# EAGLE design Clock1.1 (EAGLE 7.1.0)
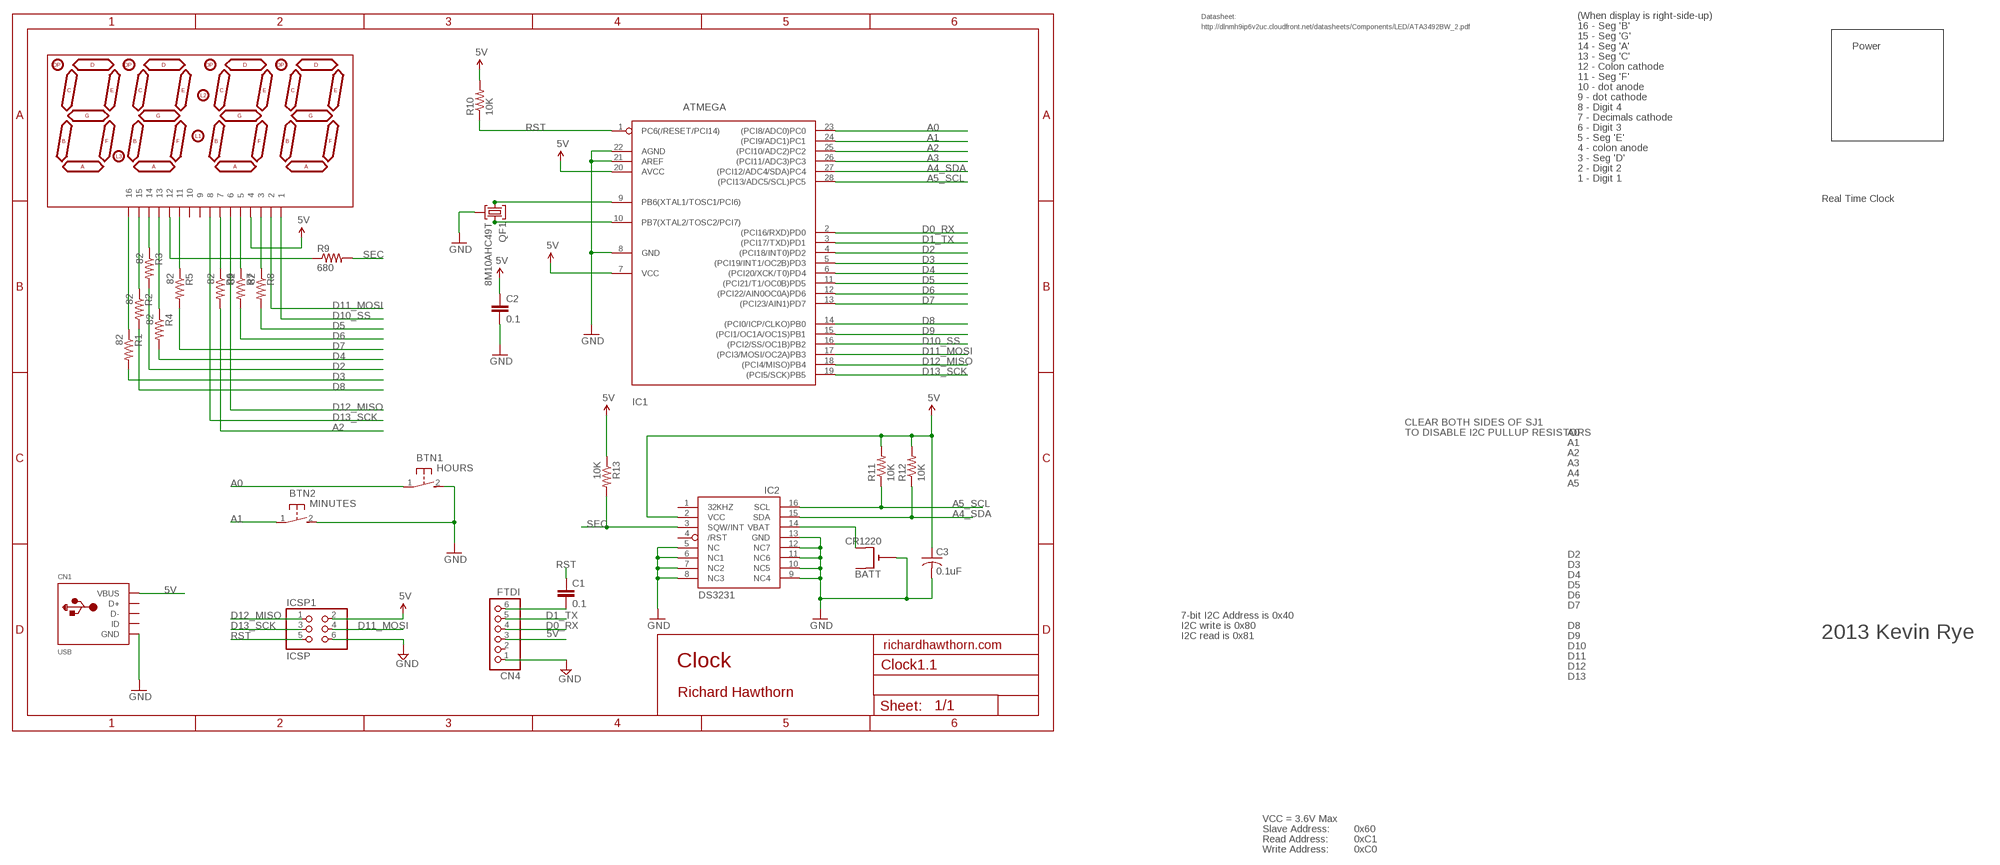
[diagram p0: schematic, sheet 1]

## Parts
BATT  CR1220  CR1220SMT  [CR1220-SMD]
BTN1  HOURS  DTS-3  [DTS-3]
BTN2  MINUTES  DTS-3  [DTS-3]
C1  0.1  CAPPTH2  [CAP-PTH-SMALL2]
C2  0.1  CAPPTH2  [CAP-PTH-SMALL2]
C3  0.1uF  C-US025-025X050  [C025-025X050]
CN1  USB  USBMINIB  [USB-MINIB]
CN4  FTDI  PINHD-1X6  [1X06]
IC1  ATMEGA  ATMEGA168PROUND  [DIL28-3-ROUND]
IC2  DS3231  DS3231/SO  [SO16W]
ICSP1  ICSP  PINHD-2X3  [2X03]
LED1  7SEG-4DIGIT  [SPARKFUN_7-SEGMENT-4DIGIT]
QF1  8M10AHC49T  [HC49U]
R1  82  R-US_0204/7  [0204/7]
R2  82  R-US_0204/7  [0204/7]
R3  82  R-US_0204/7  [0204/7]
R4  82  R-US_0204/7  [0204/7]
R5  82  R-US_0204/7  [0204/7]
R6  82  R-US_0204/7  [0204/7]
R7  82  R-US_0204/7  [0204/7]
R8  82  R-US_0204/7  [0204/7]
R9  680  R-US_0204/7  [0204/7]
R10  10K  R-US_0204/7  [0204/7]
R11  10K  R-US_0204/7  [0204/7]
R12  10K  R-US_0204/7  [0204/7]
R13  10K  R-US_0204/7  [0204/7]

## Nets
5V: C2.1 C3.1 CN1.VBUS CN4.3 IC1.7(VCC) IC1.20(AVCC) IC2.2(VCC) ICSP1.2 LED1.4 R10.2 R11.2 R12.2 R13.1
A0: BTN1.1 IC1.23((PCI8/ADC0)PC0)
A1: BTN2.1 IC1.24((PCI9/ADC1)PC1)
A2: IC1.25((PCI10/ADC2)PC2) R6.2
A3: IC1.26((PCI11/ADC3)PC3)
A4_SDA: IC1.27((PCI12/ADC4/SDA)PC4) IC2.15(SDA) R12.1
A5_SCL: IC1.28((PCI13/ADC5/SCL)PC5) IC2.16(SCL) R11.1
D0_RX: CN4.4 IC1.2((PCI16/RXD)PD0)
D1_TX: CN4.5 IC1.3((PCI17/TXD)PD1)
D2: IC1.4((PCI18/INT0)PD2) R3.2
D3: IC1.5((PCI19/INT1/OC2B)PD3) R1.2
D4: IC1.6((PCI20/XCK/T0)PD4) R4.2
D5: IC1.11((PCI21/T1/OC0B)PD5) R8.2
D6: IC1.12((PCI22/AIN0OC0A)PD6) R7.2
D7: IC1.13((PCI23/AIN1)PD7) R5.2
D8: IC1.14((PCI0/ICP/CLKO)PB0) R2.2
D9: IC1.15((PCI1/OC1A/OC1S)PB1)
D10_SS: IC1.16((PCI2/SS/OC1B)PB2) LED1.1
D11_MOSI: IC1.17((PCI3/MOSI/OC2A)PB3) ICSP1.4 LED1.2
D12_MISO: IC1.18((PCI4/MISO)PB4) ICSP1.1 LED1.6
D13_SCK: IC1.19((PCI5/SCK)PB5) ICSP1.3 LED1.8
GND [power]: BATT.- BTN1.2 BTN2.2 C2.2 C3.2 CN1.GND CN4.1 IC1.8(GND) IC1.21(AREF) IC1.22(AGND) IC2.5(NC) IC2.6(NC1) IC2.7(NC2) IC2.8(NC3) IC2.9(NC4) IC2.10(NC5) IC2.11(NC6) IC2.12(NC7) IC2.13(GND) ICSP1.6 QF1.2
N$3: LED1.16 R1.1
N$5: LED1.15 R2.1
N$6: LED1.12 R9.1
N$12: LED1.7 R6.1
N$13: BATT.+$2(+1) IC2.14(VBAT)
N$16: IC1.9(PB6(XTAL1/TOSC1/PCI6)) QF1.1
N$20: C1.2 CN4.6
N$22: LED1.13 R4.1
N$24: LED1.14 R3.1
N$25: LED1.11 R5.1
N$26: IC1.10(PB7(XTAL2/TOSC2/PCI7)) QF1.3
N$29: LED1.5 R7.1
N$30: LED1.3 R8.1
RST: C1.1 IC1.1(PC6(/RESET/PCI14)) ICSP1.5 R10.1
SEC: IC2.3(SQW/INT) R9.2 R13.2
Unconnected: BATT.+$1(+) CN1.D+ CN1.D- CN1.ID CN4.2 IC2.1(32KHZ) IC2.4(/RST) LED1.9 LED1.10

## Notes on the sheet
- Datasheet: | (When display is right-side-up)
- http://dlnmh9ip6v2uc.cloudfront.net/datasheets/Components/LED/ATA3492BW_2.pdf | 16 - Seg 'B'
- 15 - Seg 'G'
- 14 - Seg 'A' | Power
- 13 - Seg 'C'
- 12 - Colon cathode
- 11 - Seg 'F'
- 10 - dot anode
- 9 - dot cathode
- 8 - Digit 4
- 7 - Decimals cathode
- 6 - Digit 3
- 5 - Seg 'E'
- 4 - colon anode
- 3 - Seg 'D'
- 2 - Digit 2
- 1 - Digit 1
- Real Time Clock
- CLEAR BOTH SIDES OF SJ1
- TO DISABLE I2C PULLUP RESISTORS | A0
- A1
- A2
- A3
- A4
- A5
- D2
- D3
- D4
- D5
- D6
- D7
- 7-bit I2C Address is 0x40
- I2C write is 0x80 | D8
- I2C read is 0x81 | D9 | 2013 Kevin Rye
- richardhawthorn.com | D10
- D11
- Clock | D12
- D13
- Richard Hawthorn
- VCC = 3.6V Max
- Slave Address: | 0x60
- Read Address: | 0xC1
- Write Address: | 0xC0

## Library data of the parts
BATT = adafruit:CR1220: CR1216/CR1220/CR1225 12mm 3V lithium coin cell Great for battery packup. Both SMT and THM holders. Note the THM package has the ground pads on both sides of the PCB so that the masks are the same - this reduces the cost
BTN1 BTN2 = switch-tact:DTS-3
C1 C2 = LowPowerLab:CAP: Capacitor Standard 0603 ceramic capacitor, and 0.1" leaded capacitor.
C3 = adafruit:C-US: CAPACITOR, American symbol
CN1 = LowPowerLab:USB: USB Connectors USBMINIB - Surface Mount Female Mini-B USB Connector 4UConnector: 06564 By microbuilder.eu Thru-hole RA Female Mini-B USB Connector 4UConnector: 18732 By ladyada.net
CN4 = pinhead:PINHD-1X6: PIN HEADER
IC1 = adafruit:ATMEGA168*P: MICROCONTROLLER 16 kBytes FLASH 1 kBytes SRAM 512 Bytes EEPROM USART 8-channel 10 bit ADC
IC2 = adafruit:DS3231
ICSP1 = pinhead:PINHD-2X3: PIN HEADER
LED1 = sparkfun-4digit-sseg:7SEG-4DIGIT
QF1 = crystal:8M10AHC49T: Monolithic Crystal Filters Source: www.vanlong.com; OC_FARNELL: unknown; OC_NEWARK: unknown
R1-R13 = adafruit:R-US_: RESISTOR, American symbol

## Net classes
1 power: width 0.381 mm, clearance 0.254 mm

## Board
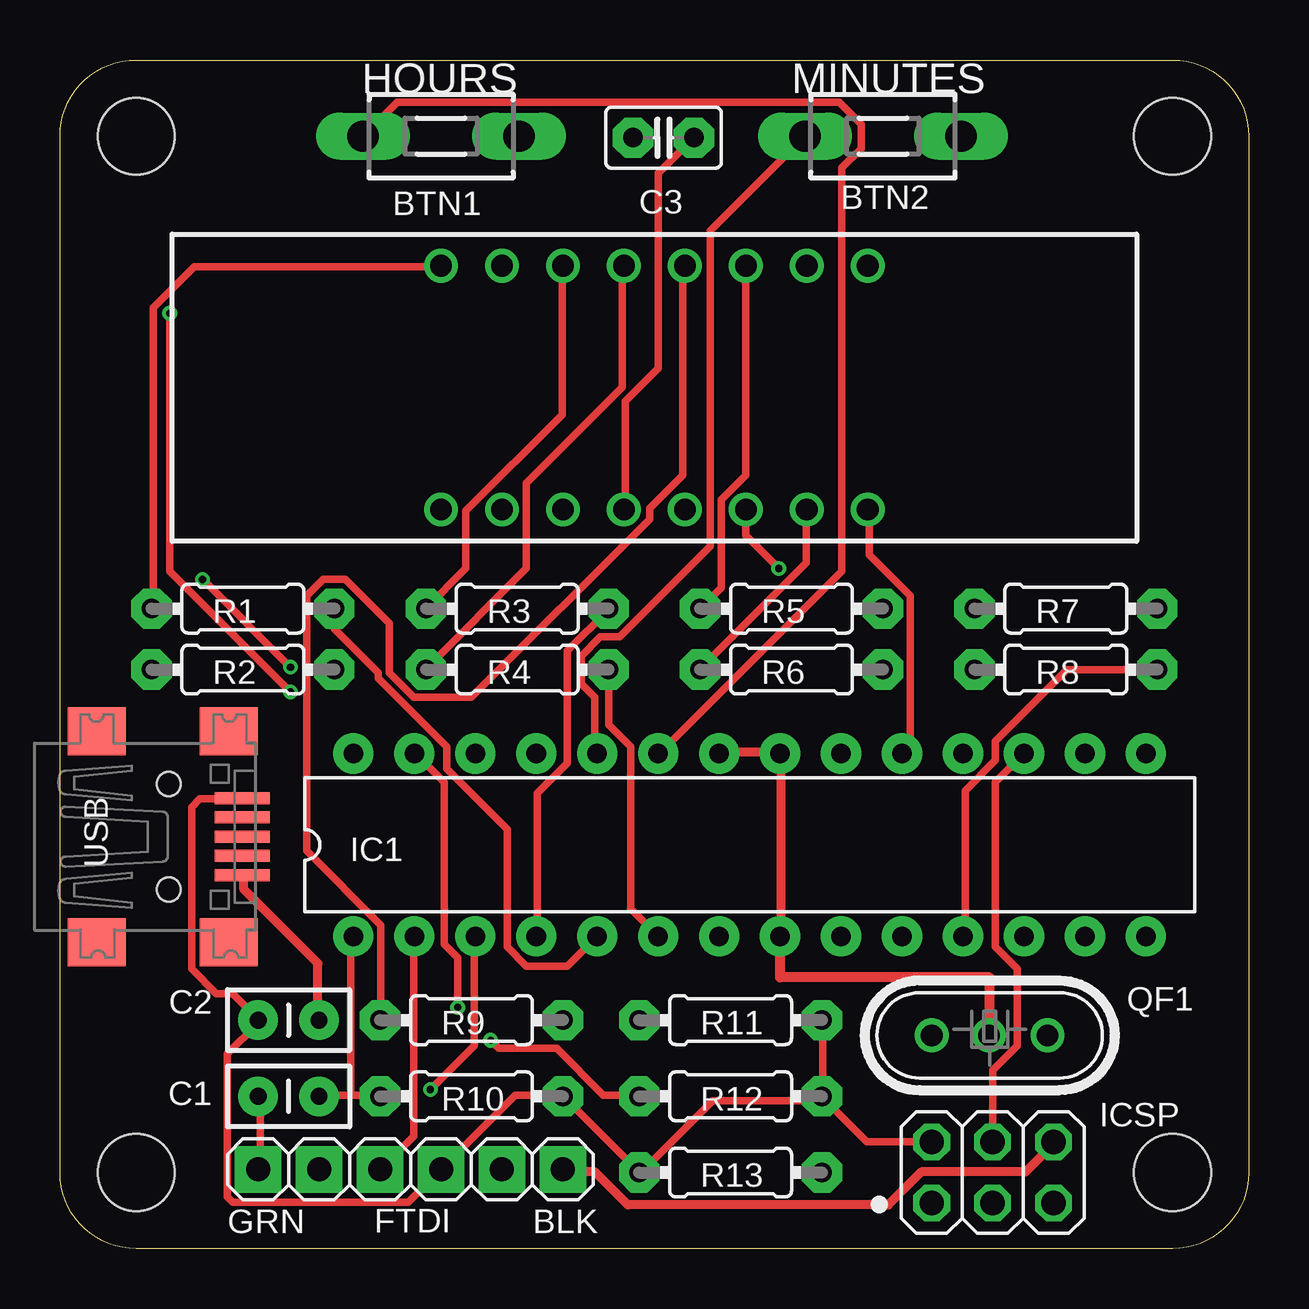
[diagram p1: board, top side]
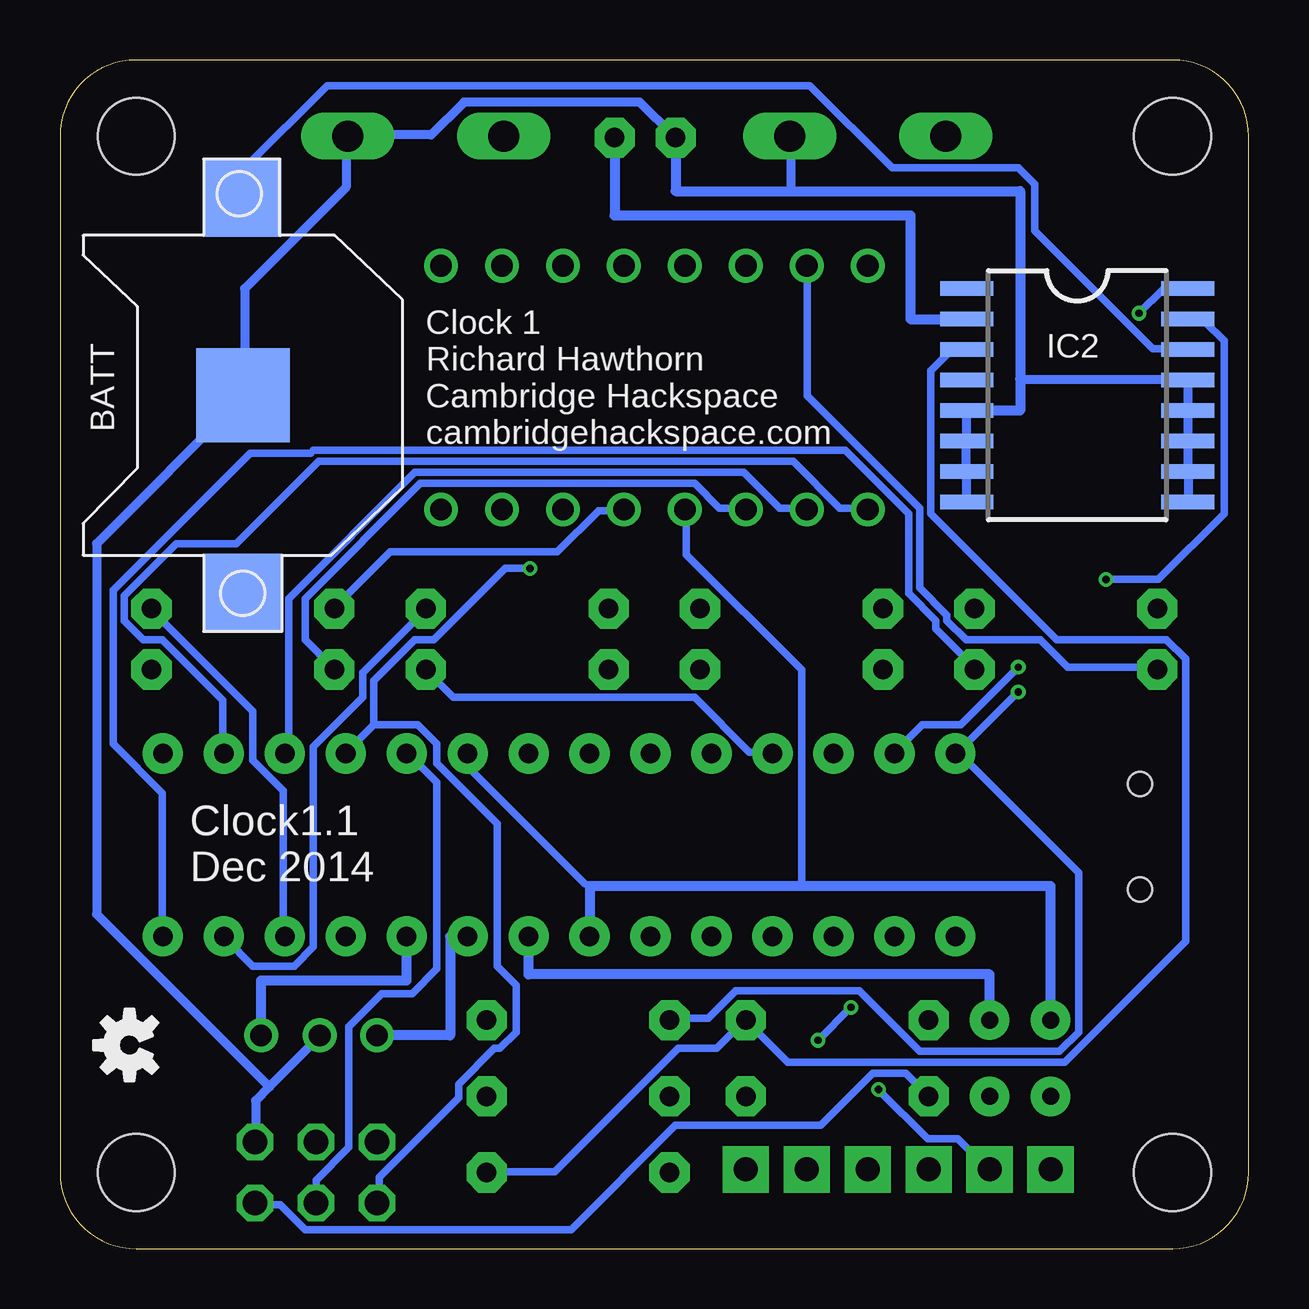
[diagram p2: board, bottom side, seen from below]

Size 49.53 x 49.53 mm. Coordinates in mm from the lower left corner, seen from the top.
Outline: 0,3.17 0,46.35 arc-90 3.17,49.53 46.35,49.53 arc-90 49.53,46.35 49.53,3.17 arc-90 46.35,0 3.17,0 arc-90 0,3.17
Copper layers (1*16): Top 0.035mm / dielectric 1.5mm / Bottom 0.035mm
Design rules "ITEADstudio_DRC *": minimum track width 12mil, minimum drill 12mil, track to track 6mil, track to pad 6mil, pad to pad 6mil, via to via 6mil, smd to smd 0mil, copper to edge 10mil, drill to drill 10mil, minimum pad ring 10mil, minimum via ring 6mil, stop-mask expansion 2mil, vias tented up to drill 100mil, thermal gap 15mil
Holes 3.2 mm at 3.17,3.17 46.35,3.17 3.17,46.35 46.35,46.35
tKeepout: area 0,0 to 5.7,5.7; area 43.8,0 to 49.5,5.7; area 43.8,43.8 to 49.5,49.5; area 0,43.8 to 5.7,49.5
bKeepout: area 0,43.8 to 5.7,49.5; area 43.8,43.8 to 49.5,49.5; area 43.8,0 to 49.5,5.7; area 0,0 to 5.7,5.7
tRestrict: area 24.3,8.9 to 29.1,12.8; area 5.8,16.9 to 6.9,18.5; area 5.2,9.7 to 6.7,10.4
bRestrict: area 27.4,17.7 to 29.2,18.7; area 21.1,13.8 to 22.9,14.9; area 21.6,12.6 to 22.1,13.2; area 20.7,12.6 to 21.2,13.2; area 20.2,12.8 to 20.7,13.5; area 20.1,13.4 to 20.6,14; area 26.5,18.9 to 27.1,19.5; area 26.5,17.9 to 27.1,18.5; area 27.5,19.1 to 28,19.8; area 27.9,18.8 to 29.1,19.6

### Footprints (pad centres in the part's own frame; a part is rotated, then mirrored left to right if it is on the bottom)
CR1220-SMD = smd 3.2 x 3.2: +$1 -8.2,0; +$2 8.2,0 | smd 3.9 x 3.9: - 0,0
DTS-3 = drill 1.3 long: 1 -3.25,0; 2 3.25,0
CAP-PTH-SMALL2 = drill 0.7 pad 1.651: 1 0,0; 2 2.54,0
C025-025X050 = drill 0.813 pad 1.676 octagon: 1 -1.27,0; 2 1.27,0
USB-MINIB = smd 0.5 x 2.308: D+ 0,4.064; D- -0.8,4.064; GND 1.6,4.064; ID 0.8,4.064; VBUS -1.6,4.064 | smd 2 x 2.4: GND1 -4.4,-2; GND2 -4.4,3.5; GND3 4.4,3.5; GND4 4.4,-2 | hole 1: -2.2,1; 2.2,1
1X06 = drill 1 pad 1.93 square: 1 -6.35,0; 2 -3.81,0; 3 -1.27,0; 4 1.27,0; 5 3.81,0; 6 6.35,0
DIL28-3-ROUND = drill 0.813 pad 1.676: 1 -16.51,-3.81; 2 -13.97,-3.81; 3 -11.43,-3.81; 4 -8.89,-3.81; 5 -6.35,-3.81; 6 -3.81,-3.81; 7 -1.27,-3.81; 8 1.27,-3.81; 9 3.81,-3.81; 10 6.35,-3.81; 11 8.89,-3.81; 12 11.43,-3.81; 13 13.97,-3.81; 14 16.51,-3.81; 15 16.51,3.81; 16 13.97,3.81; 17 11.43,3.81; 18 8.89,3.81; 19 6.35,3.81; 20 3.81,3.81; 21 1.27,3.81; 22 -1.27,3.81; 23 -3.81,3.81; 24 -6.35,3.81; 25 -8.89,3.81; 26 -11.43,3.81; 27 -13.97,3.81; 28 -16.51,3.81
SO16W = smd 0.6 x 2.2: 1 -4.445,-4.6; 2 -3.175,-4.6; 3 -1.905,-4.6; 4 -0.635,-4.6; 5 0.635,-4.6; 6 1.905,-4.6; 7 3.175,-4.6; 8 4.445,-4.6; 9 4.445,4.6; 10 3.175,4.6; 11 1.905,4.6; 12 0.635,4.6; 13 -0.635,4.6; 14 -1.905,4.6; 15 -3.175,4.6; 16 -4.445,4.6
2X03 = drill 1.016 octagon: 1 -2.54,-1.27; 2 -2.54,1.27; 3 0,-1.27; 4 0,1.27; 5 2.54,-1.27; 6 2.54,1.27
SPARKFUN_7-SEGMENT-4DIGIT = drill 0.9: 1 -8.89,-5.08; 2 -6.35,-5.08; 3 -3.81,-5.08; 4 -1.27,-5.08; 5 1.27,-5.08; 6 3.81,-5.08; 7 6.35,-5.08; 8 8.89,-5.08; 9 8.89,5.08; 10 6.35,5.08; 11 3.81,5.08; 12 1.27,5.08; 13 -1.27,5.08; 14 -3.81,5.08; 15 -6.35,5.08; 16 -8.89,5.08
HC49U = drill 0.9: 1 -2.413,0; 2 -0.027,0; 3 2.413,0
0204/7 = drill 0.813 pad 1.676 octagon: 1 -3.81,0; 2 3.81,0

### Placement (x,y rotation side)
BATT  41.91,35.56 90 bottom
BTN1  15.88,46.35 0 top
BTN2  34.29,46.35 0 top
C1  10.79,6.35 180 top
C2  8.26,9.53 0 top
C3  25.15,46.29 180 top
CN1  3.53,17.17 270 top
CN4  14.61,3.3 180 top
IC1  28.73,16.83 0 top
IC2  7.14,35.56 270 bottom
ICSP1  38.86,3.17 0 top
LED1  24.77,35.88 0 top
QF1  38.73,8.89 0 top
R1  7.62,26.67 0 top
R2  7.62,24.13 0 top
R3  19.05,26.67 0 top
R4  19.05,24.13 0 top
R5  30.48,26.67 0 top
R6  30.48,24.13 0 top
R7  41.91,26.67 0 top
R8  41.91,24.13 0 top
R9  17.14,9.53 0 top
R10  17.14,6.35 0 top
R11  27.94,9.53 0 top
R12  27.94,6.35 0 top
R13  27.94,3.17 0 top
U$3  [OSHW-LOGO-S]  46.63,8.48 90 bottom

### Tracks (layer width: path | path; a pad name or v marks a point on that pad's centre or on a via)
5V
  Top 0.305: ICSP1.2 36.23,4.46 33.6,4.46 31.77,6.29 R12.2 | R11.2 31.77,9.49 31.77,6.4 R12.2 | R12.2 31.66,6.17 27.2,6.17 24.23,3.2 R13.1 24.12,3.2 21.03,6.29 R10.2 20.8,6.4 18.97,6.4 CN4.3 14.52,1.94 7.2,1.94 6.97,2.17 6.97,8.12 8.23,9.37 C2.1 8.23,9.6 7.2,10.63 6.51,10.63 5.49,11.66 5.49,18.4 5.83,18.75 7.54,18.75 CN1.VBUS | LED1.4 23.55,30.86 23.55,35.32 24.92,36.69 24.92,44.81 26.4,46.29 C3.1
  Bottom 0.305: IC1.20 32.46,20.57 32.46,20 27.66,15.2 27.46,15.11 | 18.63,15.11 18.63,24.12 23.43,28.92 23.43,30.75 LED1.4
  Bottom 0.406: C2.1 8.26,15.11 18.63,15.11 27.46,15.11 IC1.7 | C3.1 26.42,43.05 14.1,43.05 14.1,38.73 IC2.2
A0
  Top 0.305: IC1.23 25.03,20.69 32.58,28.23 32.58,45.03 33.38,45.83 33.38,46.86 32.46,47.78 14.06,47.78 12.69,46.41 BTN1.1
A1
  Top 0.305: IC1.24 22.29,20.69 22.29,22.97 21.72,23.55 21.72,24.69 22.52,25.49 23.32,25.49 27.09,29.26 27.09,42.41 30.98,46.29 BTN2.1
A2
  Bottom 0.305: IC1.25 19.89,20.69 20.8,20.69 23.09,22.97 33.15,22.97 34.29,24.12 R6.2
A4_SDA  (via drill 0.3)
  Top 0.305: v9.6,24.23 v5.94,27.89 | v17.95,8.69 18.29,8.34 20.69,8.34 22.63,6.4 24.12,6.4 R12.1 | v16.57,10.06 16.57,12.12 16,12.69 16,19.43 14.86,20.57 IC1.27
  Bottom 0.305: v5.94,27.89 3.77,27.89 1.03,30.63 1.03,37.83 1.83,38.63 2.52,38.63 IC2.15 | v9.6,24.23 12,21.83 13.6,21.83 14.74,20.69 IC1.27 | v16.57,10.06 v17.95,8.69
A5_SCL  (via drill 0.3)
  Top 0.305: v4.57,38.98 4.57,28.23 v9.6,23.2
  Bottom 0.305: IC2.16 3.54,40.01 v4.57,38.98 | v9.6,23.2 12.12,20.69 IC1.28 12,20.57 7.09,15.66 7.09,9.03 7.89,8.23 13.72,8.23 16.23,10.74 21.37,10.74 22.52,9.6 24.12,9.6 R11.1
D0_RX
  Top 0.305: IC1.2 14.74,12.92 14.74,4.69 13.37,3.31 CN4.4
D1_TX  (via drill 0.3)
  Top 0.305: v15.43,6.63 17.26,8.46 17.26,12.92 IC1.3
  Bottom 0.305: v15.43,6.63 13.37,4.57 12.12,4.57 10.86,3.31 CN4.5
D2
  Top 0.305: IC1.4 19.89,13.03 19.89,18.97 21.14,20.23 21.14,24.92 22.86,26.63 R3.2
D3
  Top 0.305: R1.2 11.43,25.83 13.26,24 13.26,23.77 16.12,20.92 16.12,20 18.63,17.49 18.63,12.57 19.43,11.77 21.14,11.77 22.29,12.92 IC1.5
D4
  Top 0.305: R4.2 22.86,21.83 23.77,20.92 23.77,14.17 IC1.6
D5
  Top 0.305: IC1.11 37.72,13.03 37.72,19.09 38.98,20.34 38.98,21.14 41.95,24.12 45.72,24.12 R8.2
D6
  Bottom 0.305: IC1.12 40.23,13.03 40.23,19.09 41.49,20.34 41.49,22.4 45.72,26.63 R7.2
D7
  Bottom 0.305: R5.2 34.29,26.63 36.92,24 36.92,22.97 38.98,20.92 38.98,12.57 39.78,11.77 41.49,11.77 42.63,12.92 IC1.13
D8
  Bottom 0.305: IC1.14 45.26,13.03 45.26,18.97 47.32,21.03 47.32,27.43 41.6,33.15 39.09,33.15 38.98,33.26 16.8,33.26 14.17,30.63 14.17,27.32 13.03,26.18 13.03,25.83 11.43,24.23 R2.2
D10_SS
  Bottom 0.305: LED1.1 15.89,30.86 17.03,30.86 18.97,32.8 38.75,32.8 42.18,29.38 44.69,29.38 46.86,27.2 46.86,26.18 46.06,25.38 45.26,25.38 42.75,22.86 42.75,20.69 IC1.16
D11_MOSI
  Top 0.305: ICSP1.4 38.86,7.43 39.89,8.46 39.89,11.66 38.98,12.57 38.98,19.43 40.12,20.57 IC1.17
  Bottom 0.305: LED1.2 18.52,30.86 19.55,30.86 21.03,32.35 34.75,32.35 40.01,27.09 40.01,20.8 40.12,20.69 IC1.17
D12_MISO  (via drill 0.3)
  Top 0.305: LED1.6 28.57,29.72 v29.95,28.35
  Bottom 0.305: v29.95,28.35 30.98,28.35 33.95,25.38 34.75,25.38 36.46,23.66 36.46,21.83 | 36.46,21.83 37.6,20.69 IC1.18 | 36.46,21.83 34.63,21.83 33.83,21.03 33.83,20.23 31.32,17.72 31.32,11.77 30.52,10.97 30.52,9.03 31.2,8.34 31.43,8.34 32.92,6.86 32.92,6.29 36.23,2.97 36.23,1.94 ICSP1.1
D13_SCK
  Top 0.305: LED1.8 33.72,30.75 33.72,28.92 35.43,27.2 35.43,21.03 35.09,20.69 IC1.19
  Bottom 0.305: ICSP1.3 38.86,2.86 37.49,4.23 37.49,9.26 36.12,10.63 34.86,10.63 33.83,11.66 33.83,19.43 34.98,20.57 IC1.19
GND
  Top 0.381: IC1.22 27.55,20.69 29.95,20.69 IC1.21 30.06,20.46 30.06,13.14 IC1.8 | CN1.GND 7.66,15.54 7.66,14.97 10.74,11.89 10.74,9.6 C2.2 | CN4.1 21.03,3.2 22.29,3.2 23.66,1.83 34.52,1.83 35.89,3.2 40.23,3.2 41.38,4.34 ICSP1.6
  Top 0.406: QF1.2 38.73,8.89 38.73,11.3 30,11.3 IC1.8
  Bottom 0.381: 40.8,6.74 38.75,8.8 QF1.2 | 40.8,6.74 41.38,6.17 41.38,4.46 ICSP1.6 | IC2.9 2.52,31.2 2.52,32.35 IC2.10 2.52,32.46 2.52,33.6 IC2.11 2.52,33.83 2.52,34.86 IC2.12 2.52,35.09 2.52,36.12 IC2.13 2.63,36.23 9.53,36.23 | IC2.5 11.77,34.75 11.77,33.72 IC2.6 11.77,33.49 11.77,32.46 IC2.7 11.77,32.35 11.77,31.2 IC2.8 | 19.09,44.07 19.09,46.29 BTN1.2 | C3.2 24,46.41 25.38,47.78 32.69,47.78 34.06,46.41 37.38,46.41 BTN2.2 37.6,46.29 37.6,44.23 41.83,40.01 41.83,35.66 BATT.- 41.95,35.43 48.01,29.38 48.01,13.95 40.8,6.74
  Bottom 0.406: C2.2 10.79,11.43 30,11.43 IC1.8 | C3.2 23.88,44.07 19.09,44.07 9.53,44.07 9.53,36.23 9.53,34.92 IC2.5
N$3
  Top 0.305: LED1.16 15.77,40.92 5.6,40.92 3.89,39.2 3.89,26.75 R1.1
N$5
  Bottom 0.305: LED1.15 18.4,40.92 18.4,35.55 13.72,30.86 13.72,27.55 12.57,26.4 12.57,26.18 11.77,25.38 8.69,25.38 7.54,24.23 3.89,24.23 R2.1
N$6
  Top 0.305: LED1.12 25.95,40.92 25.95,32.23 24.57,30.86 24.57,30.4 17.14,22.97 14.74,22.97 13.72,24 13.72,26.06 11.89,27.89 10.97,27.89 10.29,27.2 10.29,16.57 13.37,13.49 13.37,9.6 R9.1
N$12
  Top 0.305: LED1.7 31.09,30.75 31.09,28.57 26.75,24.23 R6.1
N$13
  Bottom 0.305: IC2.14 2.63,37.49 4,37.49 8.91,42.41 8.91,44.35 9.6,45.03 14.86,45.03 18.29,48.46 38.41,48.46 41.83,45.03 41.83,43.78 BATT.+$2
N$16
  Bottom 0.406: IC1.9 33.27,13.02 33.27,8.89 QF1.1
N$20
  Top 0.305: C1.2 8.34,6.29 8.34,3.31 CN4.6
N$22
  Top 0.305: LED1.13 23.43,40.92 23.43,35.89 19.43,31.89 19.43,28.35 15.32,24.23 R4.1
N$24
  Top 0.305: R3.1 16.92,28.35 16.92,30.75 20.92,34.75 20.92,40.92 LED1.14
N$25
  Top 0.305: LED1.11 28.57,32.23 27.55,31.2 27.55,27.55 R5.1
N$26
  Bottom 0.406: QF1.3 41.15,11.18 35.08,11.18 IC1.10
N$29
  Bottom 0.305: LED1.5 26.06,30.75 27.09,30.75 28.8,29.03 35.78,29.03 38.06,26.75 R7.1
N$30
  Bottom 0.305: LED1.3 21.03,30.86 22.06,30.86 23.09,31.89 34.52,31.89 39.32,27.09 39.32,25.38 38.18,24.23 R8.1
RST
  Top 0.305: 12.12,6.4 13.26,6.4 R10.1 | 12.12,6.4 10.86,6.4 C1.1 | 12.12,6.4 12.12,12.92 IC1.1
  Bottom 0.305: ICSP1.5 41.38,1.83 40.35,1.83 39.32,0.8 28.23,0.8 23.89,5.14 17.83,5.14 15.66,7.32 14.29,7.32 13.37,6.4 R10.1
SEC
  Bottom 0.305: IC2.3 11.77,37.38 12.46,37.38 13.26,36.58 13.26,30.63 8,25.38 3.43,25.38 2.63,24.57 2.63,12.8 7.66,7.77 19.2,7.77 R9.2 21.03,9.49 22.17,8.34 23.77,8.34 28.92,3.2 31.66,3.2 R13.2

### Text on the board
tNames: GRN | FTDI | BLK
bNames: Clock 1 / Richard Hawthorn / Cambridge Hackspace / cambridgehackspace.com | Clock1.1 / Dec 2014
tDocu: REG